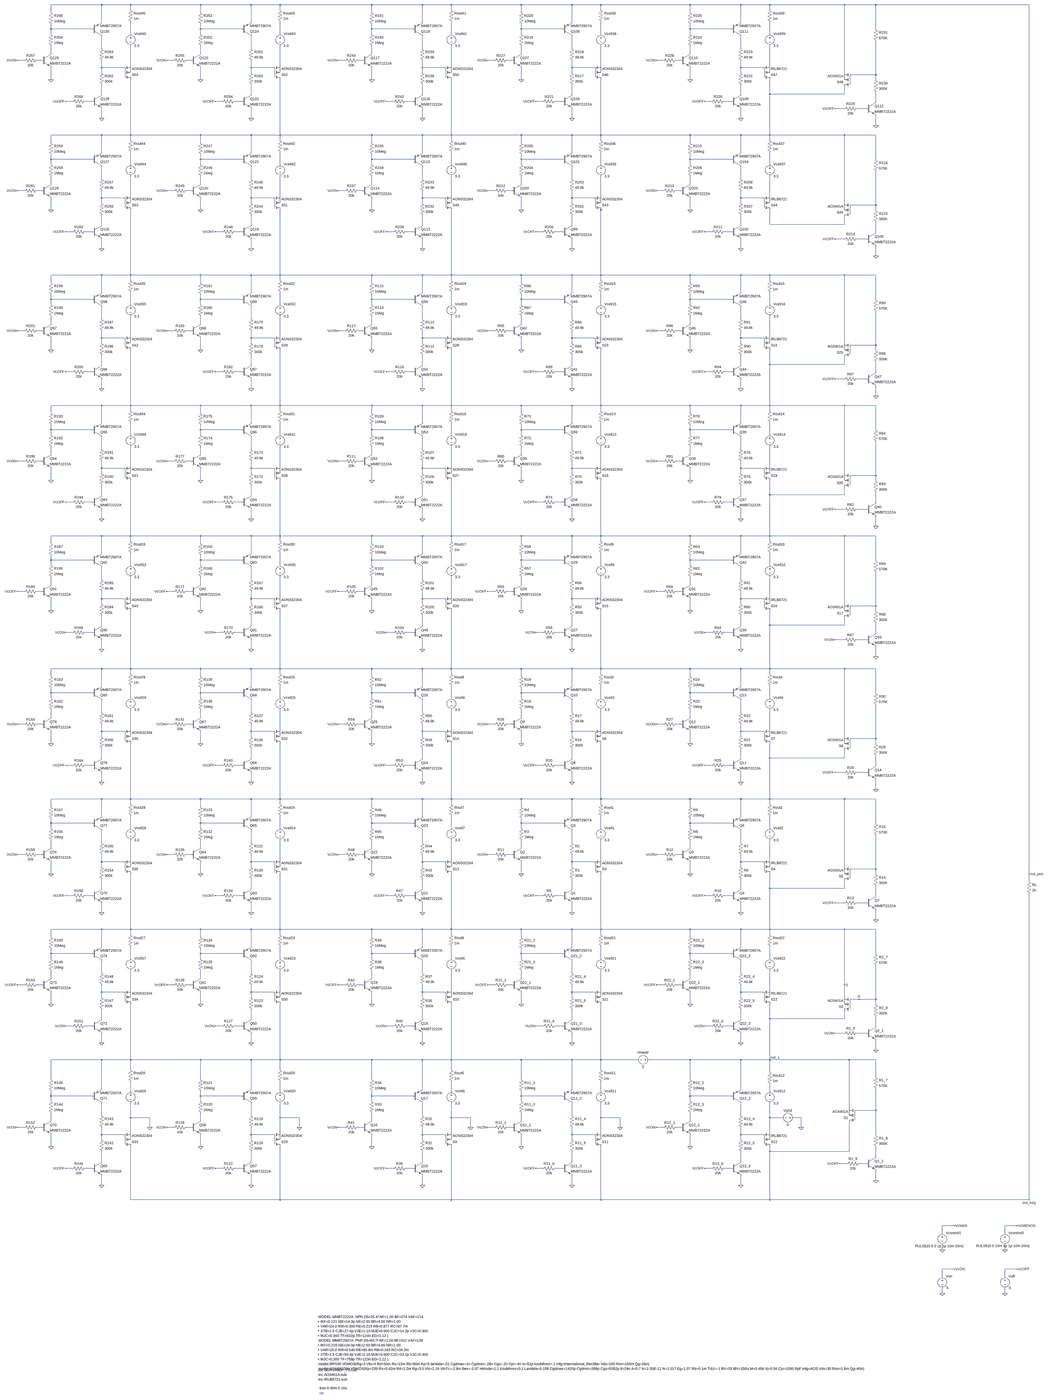
[diagram p0: schematic Matriz_5x9.asc, whole sheet]
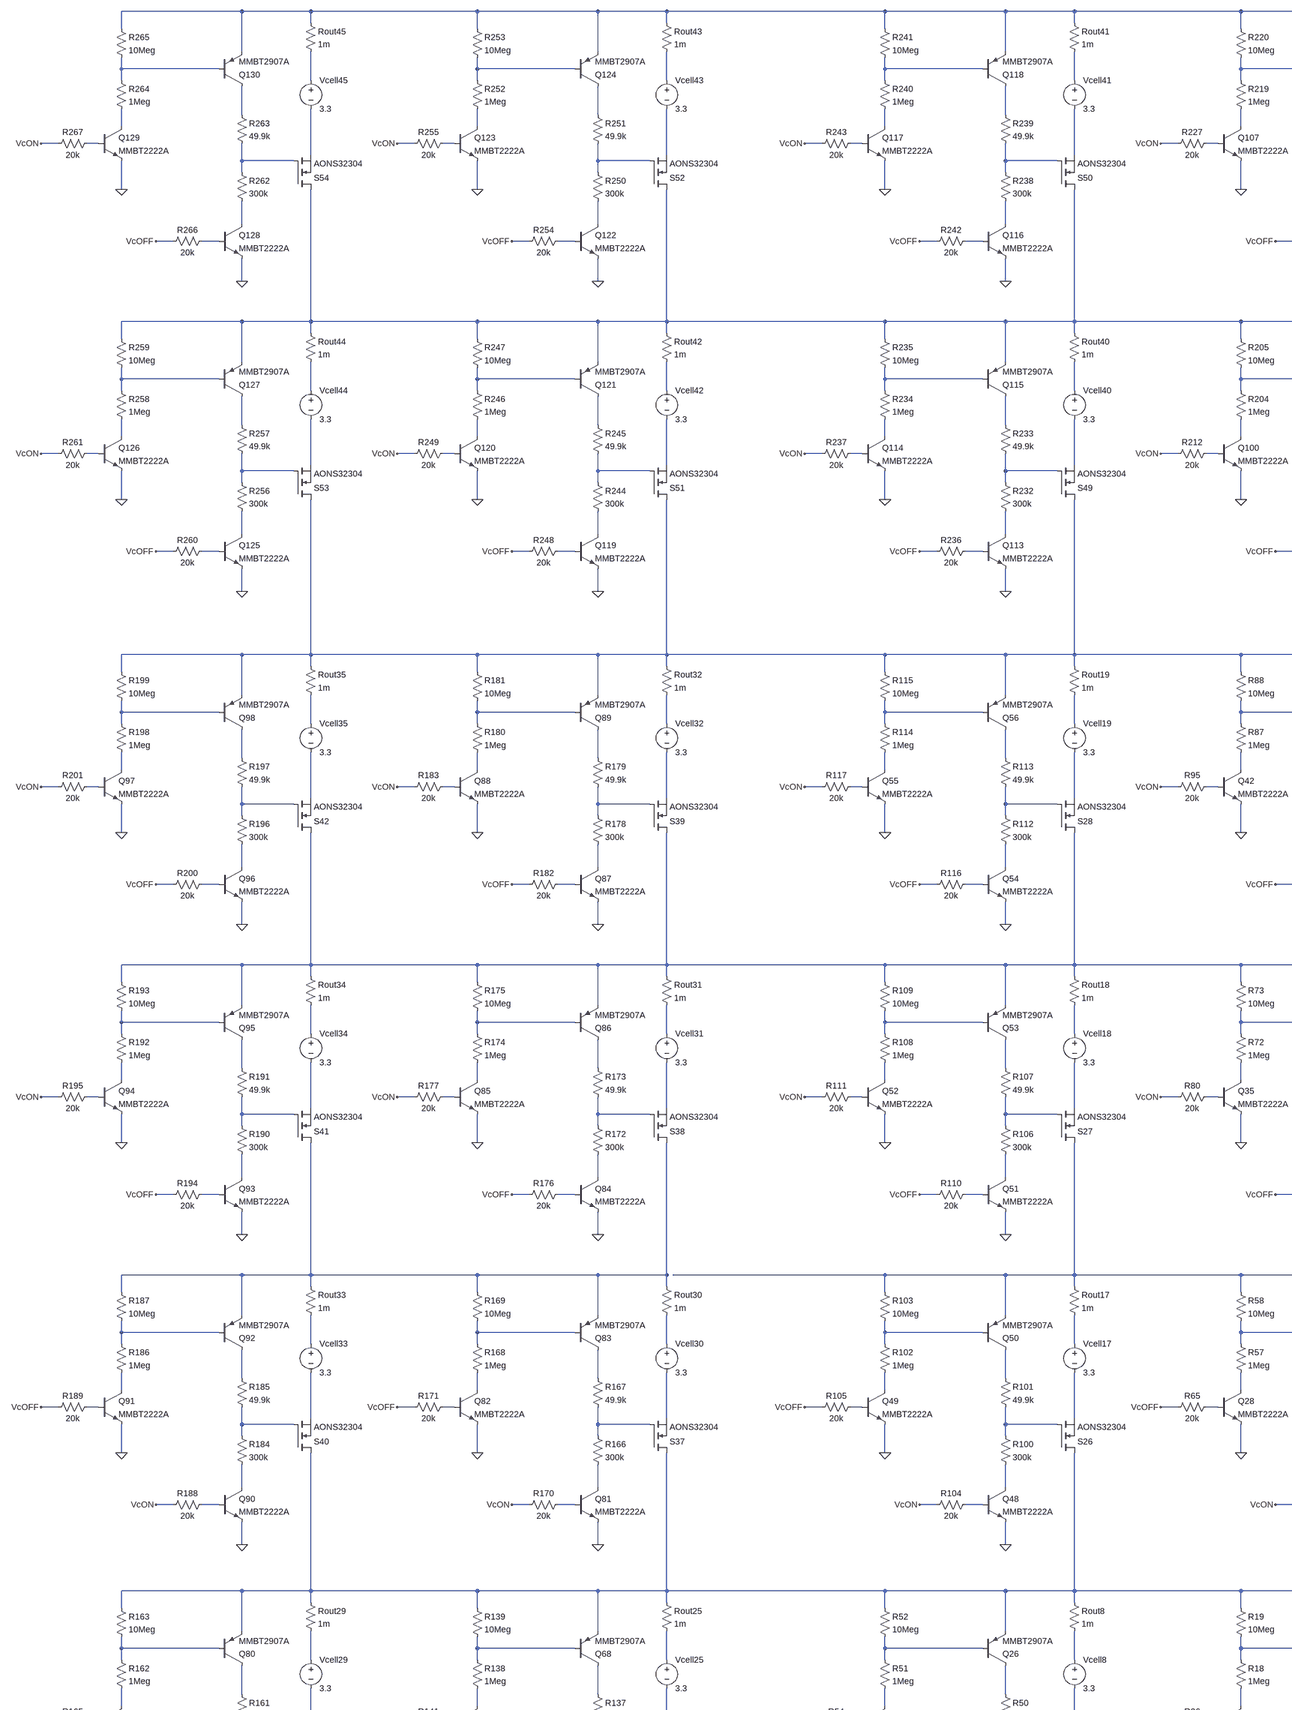
[diagram p1: schematic Matriz_5x9.asc, part, row 1 of 2, column 1 of 2]
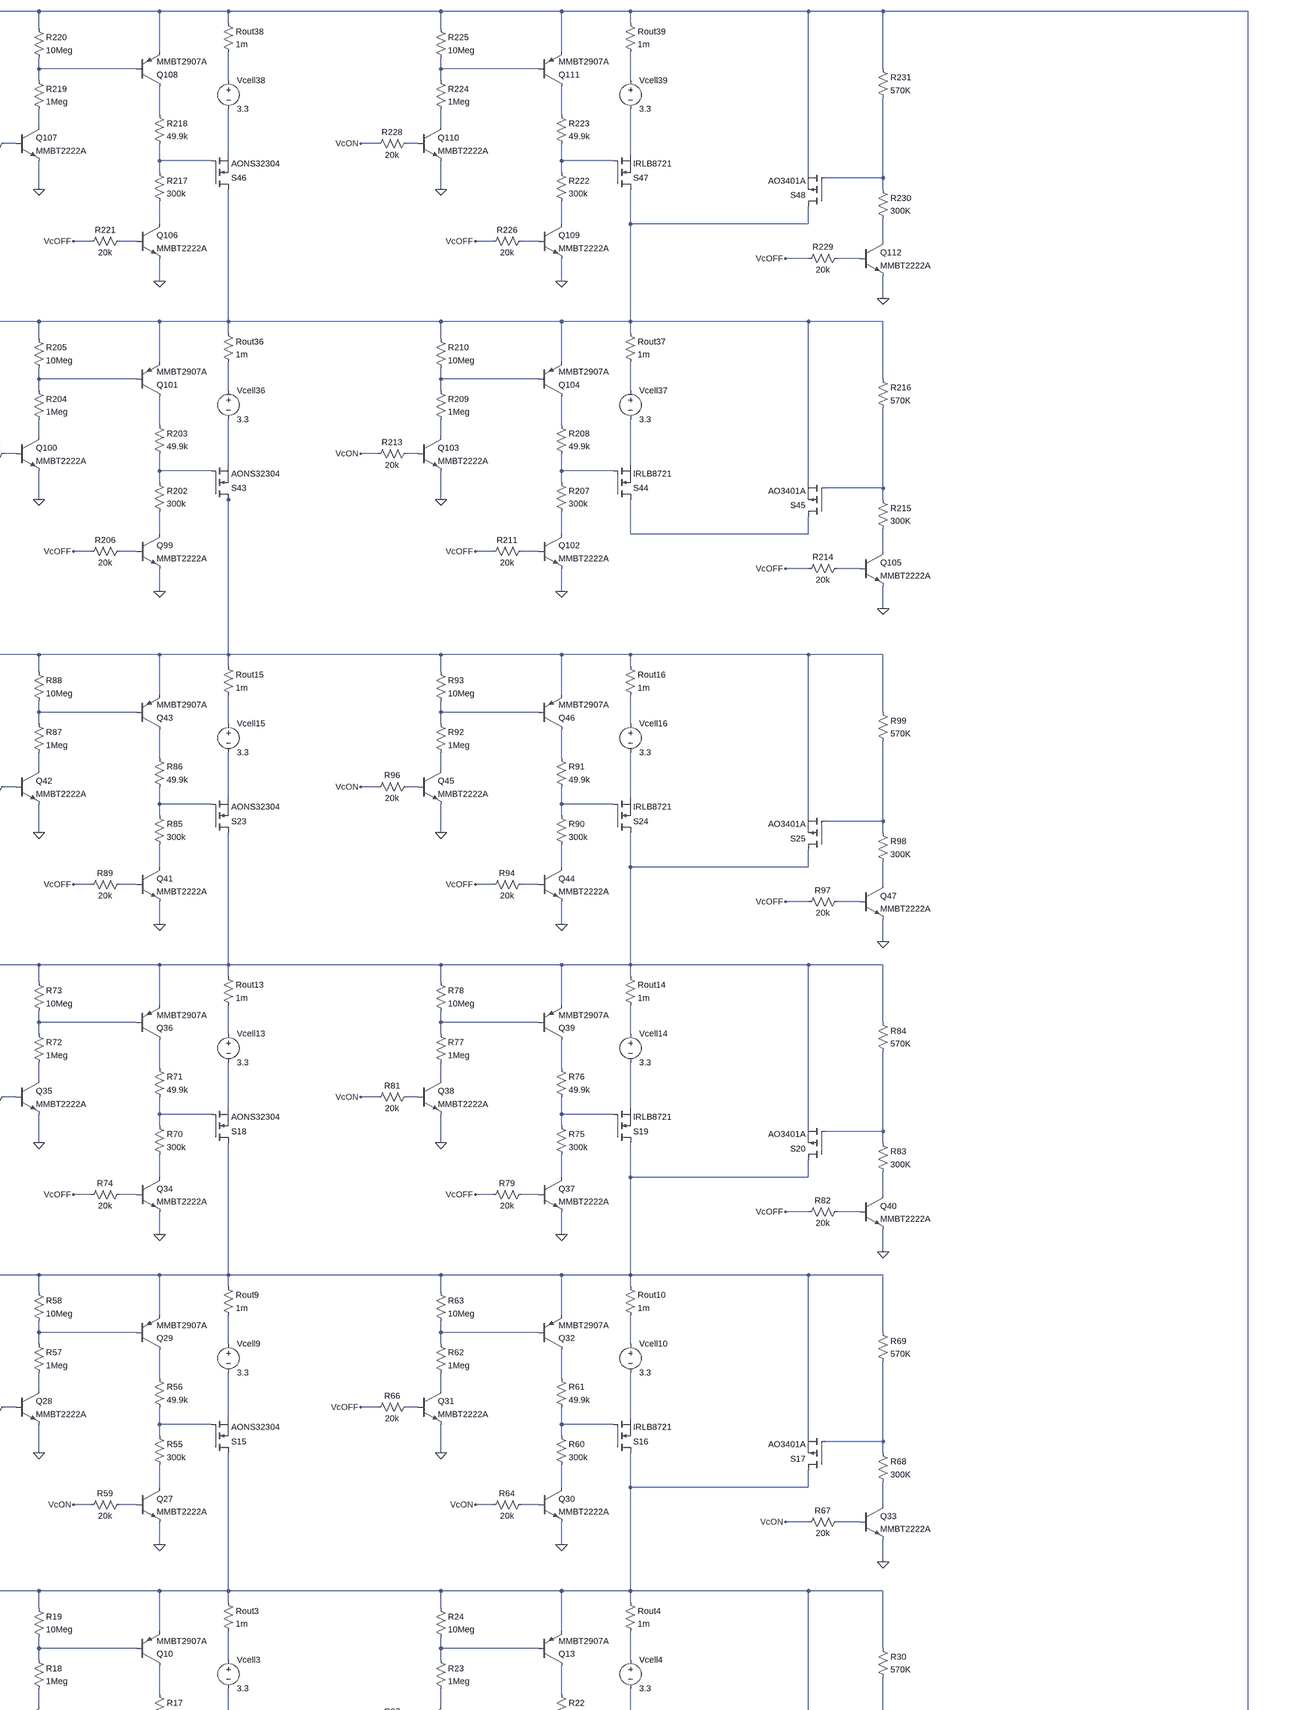
[diagram p2: schematic Matriz_5x9.asc, part, row 1 of 2, column 2 of 2]
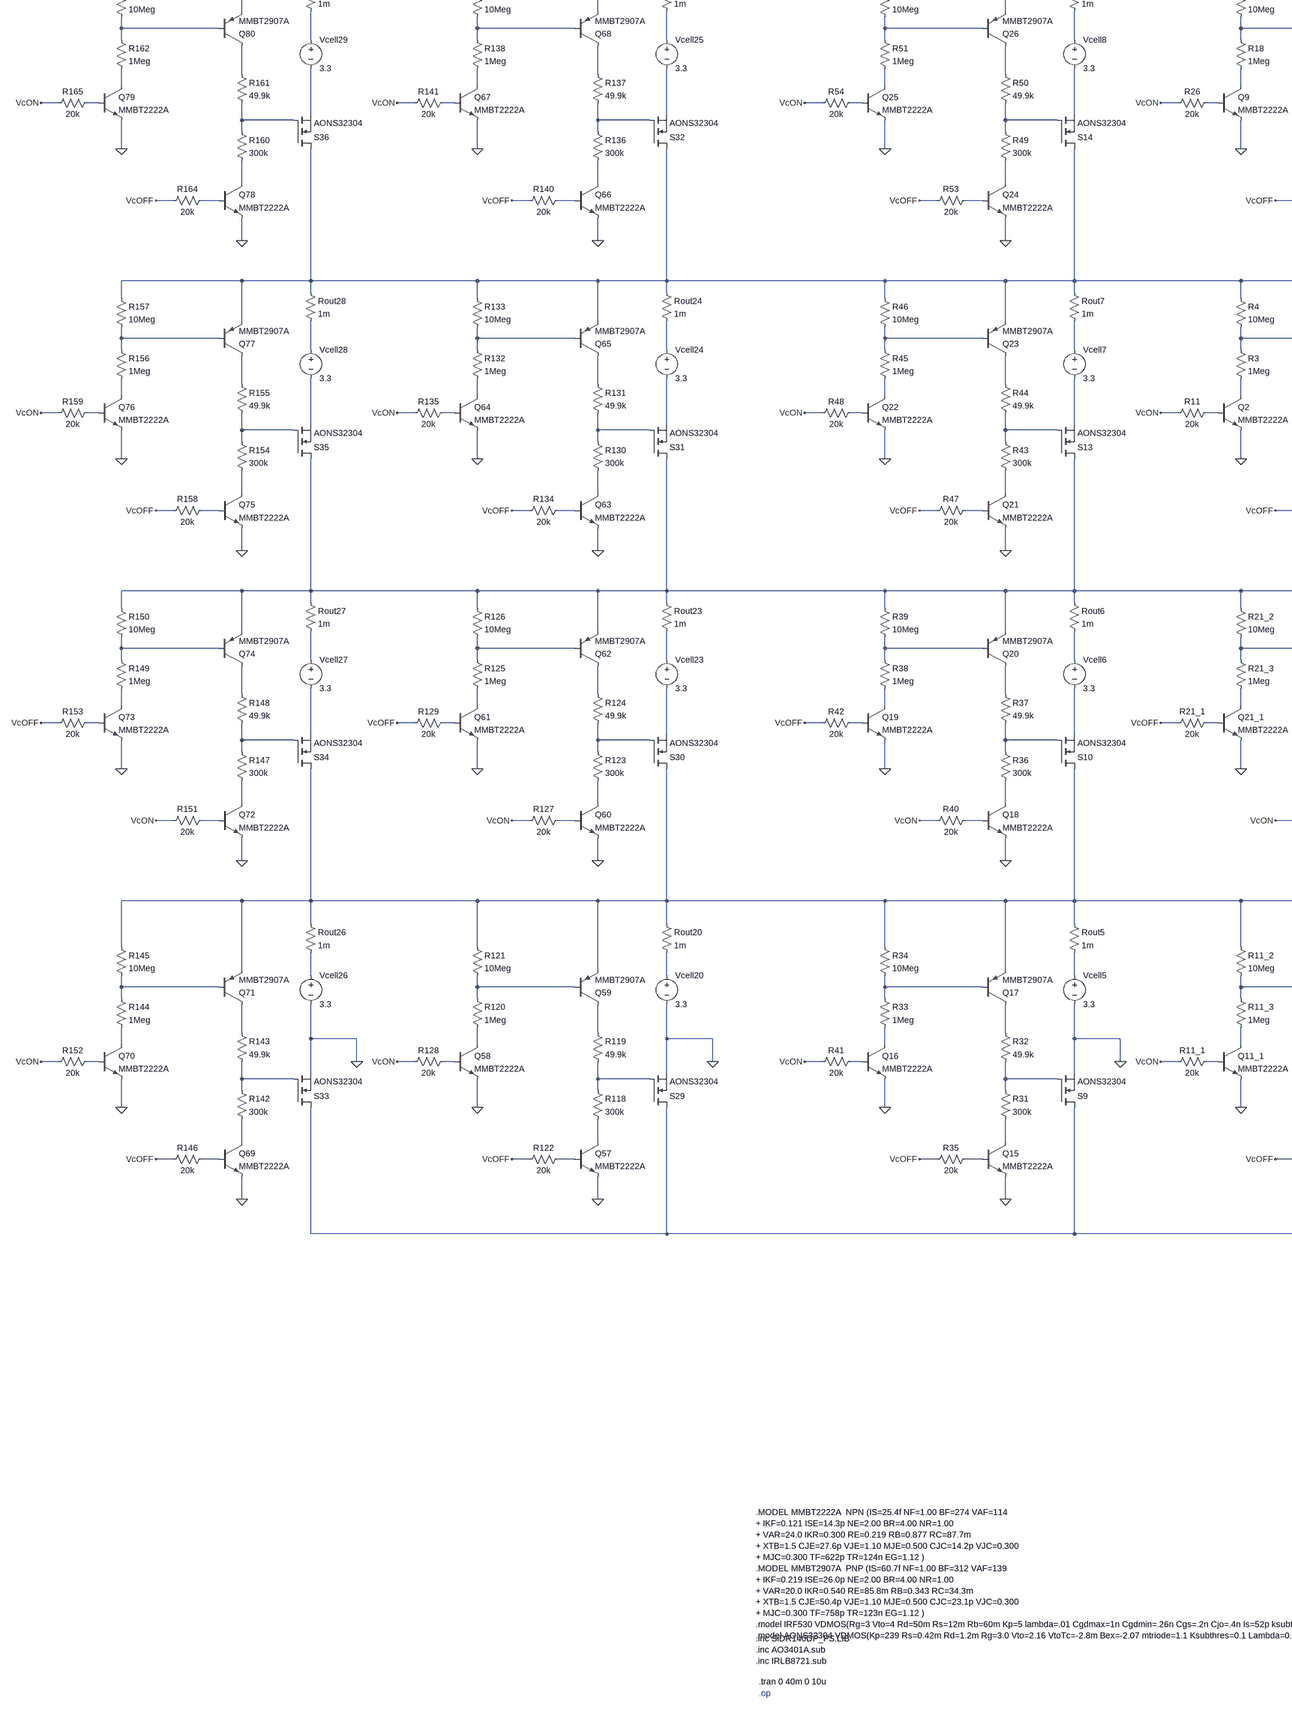
[diagram p3: schematic Matriz_5x9.asc, part, row 2 of 2, column 1 of 2]
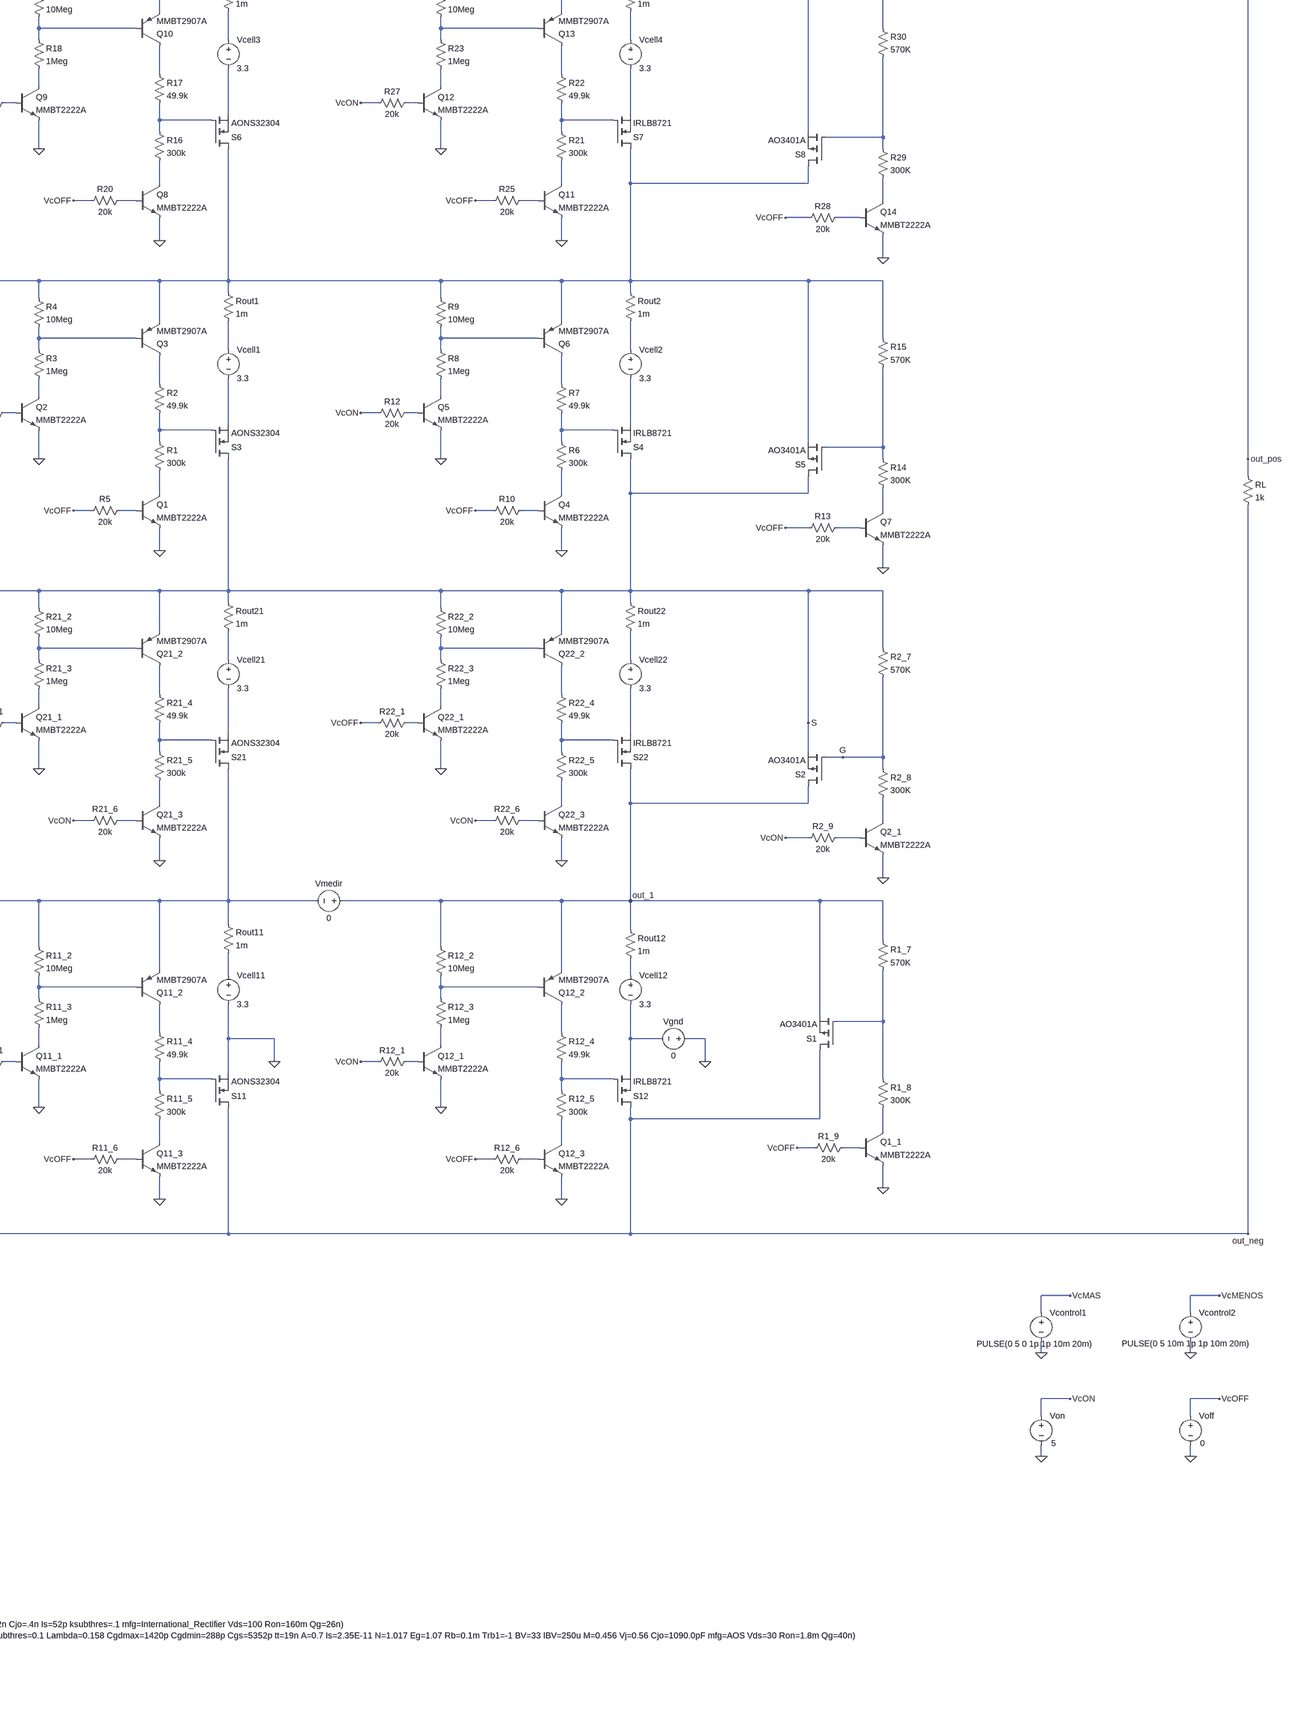
[diagram p4: schematic Matriz_5x9.asc, part, row 2 of 2, column 2 of 2]
* Matriz_5x9.asc
Q11_3 N429 N435 0 0 MMBT2222A
R11_5 N423 N429 300k
R11_4 N407 N423 49.9k
Q11_1 N413 N418 0 0 MMBT2222A
R11_3 N401 N413 1Meg
R11_2 N392 N401 10Meg
R11_6 N435 VcOFF 20k
Vcell11 N396 0 3.3
Q11_2 N407 N401 N392 0 MMBT2907A
M§S11 out_neg N423 0 0 AONS32304
Q12_3 N430 N436 0 0 MMBT2222A
R12_5 N424 N430 300k
R12_4 N408 N424 49.9k
Q12_1 N414 N419 0 0 MMBT2222A
R12_3 N402 N414 1Meg
R12_2 out_1 N402 10Meg
R12_6 N436 VcOFF 20k
Vcell12 N397 N409 3.3
Q12_2 N408 N402 out_1 0 MMBT2907A
XS12 out_neg N424 N409 IRLB8721  ; pins D G S
Q21_3 N383 N388 0 0 MMBT2222A
R21_5 N378 N383 300k
R21_4 N358 N378 49.9k
Q21_1 N363 N368 0 0 MMBT2222A
R21_3 N348 N363 1Meg
R21_2 S N348 10Meg
R21_6 N388 VcON 20k
Vcell21 N353 N373 3.3
Q21_2 N358 N348 S 0 MMBT2907A
M§S21 N392 N378 N373 N373 AONS32304
Q22_3 N384 N389 0 0 MMBT2222A
R22_5 N379 N384 300k
R22_4 N359 N379 49.9k
Q22_1 N364 N369 0 0 MMBT2222A
R22_3 N349 N364 1Meg
R22_2 S N349 10Meg
R22_6 N389 VcON 20k
Vcell22 N354 N374 3.3
Q22_2 N359 N349 S 0 MMBT2907A
XS22 out_1 N379 N374 IRLB8721  ; pins D G S
Vcontrol1 VcMAS 0 PULSE(0 5 0 1p 1p 10m 20m)
Vcontrol2 VcMENOS 0 PULSE(0 5 10m 1p 1p 10m 20m)
Voff VcOFF 0 0
Von VcON 0 5
R11_1 N418 VcON 20k
R21_1 N368 VcOFF 20k
R22_1 N369 VcOFF 20k
R12_1 N419 VcON 20k
RL out_pos out_neg 1k
Rout12 out_1 N397 1m
Rout11 N392 N396 1m
Rout21 S N353 1m
Rout22 S N354 1m
Vmedir out_1 N392 0
Vgnd 0 N409 0
Q1_1 N425 N431 0 0 MMBT2222A
R1_9 N431 VcOFF 20k
R1_8 N403 N425 300K
R1_7 out_1 N403 570K
Q2_1 N390 N391 0 0 MMBT2222A
R2_9 N391 VcON 20k
R2_8 G N390 300K
R2_7 S G 570K
XS1 out_neg N403 out_1 AO3401A  ; pins D G S
XS2 out_1 G S AO3401A  ; pins D G S
Q1 N336 N341 0 0 MMBT2222A
R1 N330 N336 300k
R2 N310 N330 49.9k
Q2 N315 N320 0 0 MMBT2222A
R3 N300 N315 1Meg
R4 N289 N300 10Meg
R5 N341 VcOFF 20k
Vcell1 N305 N325 3.3
Q3 N310 N300 N289 0 MMBT2907A
M§S3 S N330 N325 N325 AONS32304
Q4 N337 N342 0 0 MMBT2222A
R6 N331 N337 300k
R7 N311 N331 49.9k
Q5 N316 N321 0 0 MMBT2222A
R8 N301 N316 1Meg
R9 N289 N301 10Meg
R10 N342 VcOFF 20k
Vcell2 N306 N326 3.3
Q6 N311 N301 N289 0 MMBT2907A
XS4 S N331 N326 IRLB8721  ; pins D G S
R11 N320 VcON 20k
R12 N321 VcON 20k
Rout1 N289 N305 1m
Rout2 N289 N306 1m
Q7 N343 N344 0 0 MMBT2222A
R13 N344 VcOFF 20k
R14 N332 N343 300K
R15 N289 N332 570K
XS5 S N332 N289 AO3401A  ; pins D G S
Q8 N287 N293 0 0 MMBT2222A
R16 N281 N287 300k
R17 N261 N281 49.9k
Q9 N266 N271 0 0 MMBT2222A
R18 N251 N266 1Meg
R19 N240 N251 10Meg
R20 N293 VcOFF 20k
Vcell3 N256 N276 3.3
Q10 N261 N251 N240 0 MMBT2907A
M§S6 N289 N281 N276 N276 AONS32304
Q11 N288 N294 0 0 MMBT2222A
R21 N282 N288 300k
R22 N262 N282 49.9k
Q12 N267 N272 0 0 MMBT2222A
R23 N252 N267 1Meg
R24 N240 N252 10Meg
R25 N294 VcOFF 20k
Vcell4 N257 N277 3.3
Q13 N262 N252 N240 0 MMBT2907A
XS7 N289 N282 N277 IRLB8721  ; pins D G S
R26 N271 VcON 20k
R27 N272 VcON 20k
Rout3 N240 N256 1m
Rout4 N240 N257 1m
Q14 N295 N296 0 0 MMBT2222A
R28 N296 VcOFF 20k
R29 N283 N295 300K
R30 N240 N283 570K
XS8 N289 N283 N240 AO3401A  ; pins D G S
Q15 N428 N434 0 0 MMBT2222A
R31 N422 N428 300k
R32 N406 N422 49.9k
Q16 N412 N417 0 0 MMBT2222A
R33 N400 N412 1Meg
R34 N392 N400 10Meg
R35 N434 VcOFF 20k
Vcell5 N395 0 3.3
Q17 N406 N400 N392 0 MMBT2907A
M§S9 out_neg N422 0 0 AONS32304
Q18 N382 N387 0 0 MMBT2222A
R36 N377 N382 300k
R37 N357 N377 49.9k
Q19 N362 N367 0 0 MMBT2222A
R38 N347 N362 1Meg
R39 S N347 10Meg
R40 N387 VcON 20k
Vcell6 N352 N372 3.3
Q20 N357 N347 S 0 MMBT2907A
M§S10 N392 N377 N372 N372 AONS32304
R41 N417 VcON 20k
R42 N367 VcOFF 20k
Rout5 N392 N395 1m
Rout6 S N352 1m
Q21 N335 N340 0 0 MMBT2222A
R43 N329 N335 300k
R44 N309 N329 49.9k
Q22 N314 N319 0 0 MMBT2222A
R45 N299 N314 1Meg
R46 N289 N299 10Meg
R47 N340 VcOFF 20k
Vcell7 N304 N324 3.3
Q23 N309 N299 N289 0 MMBT2907A
M§S13 S N329 N324 N324 AONS32304
R48 N319 VcON 20k
Rout7 N289 N304 1m
Q24 N286 N292 0 0 MMBT2222A
R49 N280 N286 300k
R50 N260 N280 49.9k
Q25 N265 N270 0 0 MMBT2222A
R51 N250 N265 1Meg
R52 N240 N250 10Meg
R53 N292 VcOFF 20k
Vcell8 N255 N275 3.3
Q26 N260 N250 N240 0 MMBT2907A
M§S14 N289 N280 N275 N275 AONS32304
R54 N270 VcON 20k
Rout8 N240 N255 1m
Q27 N238 N244 0 0 MMBT2222A
R55 N232 N238 300k
R56 N212 N232 49.9k
Q28 N217 N222 0 0 MMBT2222A
R57 N202 N217 1Meg
R58 N190 N202 10Meg
R59 N244 VcON 20k
Vcell9 N207 N227 3.3
Q29 N212 N202 N190 0 MMBT2907A
M§S15 N240 N232 N227 N227 AONS32304
Q30 N239 N245 0 0 MMBT2222A
R60 N233 N239 300k
R61 N213 N233 49.9k
Q31 N218 N223 0 0 MMBT2222A
R62 N203 N218 1Meg
R63 N190 N203 10Meg
R64 N245 VcON 20k
Vcell10 N208 N228 3.3
Q32 N213 N203 N190 0 MMBT2907A
XS16 N240 N233 N228 IRLB8721  ; pins D G S
R65 N222 VcOFF 20k
R66 N223 VcOFF 20k
Rout9 N190 N207 1m
Rout10 N190 N208 1m
Q33 N246 N247 0 0 MMBT2222A
R67 N247 VcON 20k
R68 N234 N246 300K
R69 N190 N234 570K
XS17 N240 N234 N190 AO3401A  ; pins D G S
Q34 N188 N194 0 0 MMBT2222A
R70 N182 N188 300k
R71 N162 N182 49.9k
Q35 N167 N172 0 0 MMBT2222A
R72 N152 N167 1Meg
R73 N141 N152 10Meg
R74 N194 VcOFF 20k
Vcell13 N157 N177 3.3
Q36 N162 N152 N141 0 MMBT2907A
M§S18 N190 N182 N177 N177 AONS32304
Q37 N189 N195 0 0 MMBT2222A
R75 N183 N189 300k
R76 N163 N183 49.9k
Q38 N168 N173 0 0 MMBT2222A
R77 N153 N168 1Meg
R78 N141 N153 10Meg
R79 N195 VcOFF 20k
Vcell14 N158 N178 3.3
Q39 N163 N153 N141 0 MMBT2907A
XS19 N190 N183 N178 IRLB8721  ; pins D G S
R80 N172 VcON 20k
R81 N173 VcON 20k
Rout13 N141 N157 1m
Rout14 N141 N158 1m
Q40 N196 N197 0 0 MMBT2222A
R82 N197 VcOFF 20k
R83 N184 N196 300K
R84 N141 N184 570K
XS20 N190 N184 N141 AO3401A  ; pins D G S
Q41 N139 N145 0 0 MMBT2222A
R85 N133 N139 300k
R86 N113 N133 49.9k
Q42 N118 N123 0 0 MMBT2222A
R87 N103 N118 1Meg
R88 N086 N103 10Meg
R89 N145 VcOFF 20k
Vcell15 N108 N128 3.3
Q43 N113 N103 N086 0 MMBT2907A
M§S23 N141 N133 N128 N128 AONS32304
Q44 N140 N146 0 0 MMBT2222A
R90 N134 N140 300k
R91 N114 N134 49.9k
Q45 N119 N124 0 0 MMBT2222A
R92 N104 N119 1Meg
R93 N086 N104 10Meg
R94 N146 VcOFF 20k
Vcell16 N109 N129 3.3
Q46 N114 N104 N086 0 MMBT2907A
XS24 N141 N134 N129 IRLB8721  ; pins D G S
R95 N123 VcON 20k
R96 N124 VcON 20k
Rout15 N086 N108 1m
Rout16 N086 N109 1m
Q47 N147 N148 0 0 MMBT2222A
R97 N148 VcOFF 20k
R98 N135 N147 300K
R99 N086 N135 570K
XS25 N141 N135 N086 AO3401A  ; pins D G S
Q48 N237 N243 0 0 MMBT2222A
R100 N231 N237 300k
R101 N211 N231 49.9k
Q49 N216 N221 0 0 MMBT2222A
R102 N201 N216 1Meg
R103 N190 N201 10Meg
R104 N243 VcON 20k
Vcell17 N206 N226 3.3
Q50 N211 N201 N190 0 MMBT2907A
M§S26 N240 N231 N226 N226 AONS32304
R105 N221 VcOFF 20k
Rout17 N190 N206 1m
Q51 N187 N193 0 0 MMBT2222A
R106 N181 N187 300k
R107 N161 N181 49.9k
Q52 N166 N171 0 0 MMBT2222A
R108 N151 N166 1Meg
R109 N141 N151 10Meg
R110 N193 VcOFF 20k
Vcell18 N156 N176 3.3
Q53 N161 N151 N141 0 MMBT2907A
M§S27 N190 N181 N176 N176 AONS32304
R111 N171 VcON 20k
Rout18 N141 N156 1m
Q54 N138 N144 0 0 MMBT2222A
R112 N132 N138 300k
R113 N112 N132 49.9k
Q55 N117 N122 0 0 MMBT2222A
R114 N102 N117 1Meg
R115 N086 N102 10Meg
R116 N144 VcOFF 20k
Vcell19 N107 N127 3.3
Q56 N112 N102 N086 0 MMBT2907A
M§S28 N141 N132 N127 N127 AONS32304
R117 N122 VcON 20k
Rout19 N086 N107 1m
Q57 N427 N433 0 0 MMBT2222A
R118 N421 N427 300k
R119 N405 N421 49.9k
Q58 N411 N416 0 0 MMBT2222A
R120 N399 N411 1Meg
R121 N392 N399 10Meg
R122 N433 VcOFF 20k
Vcell20 N394 0 3.3
Q59 N405 N399 N392 0 MMBT2907A
M§S29 out_neg N421 0 0 AONS32304
Q60 N381 N386 0 0 MMBT2222A
R123 N376 N381 300k
R124 N356 N376 49.9k
Q61 N361 N366 0 0 MMBT2222A
R125 N346 N361 1Meg
R126 S N346 10Meg
R127 N386 VcON 20k
Vcell23 N351 N371 3.3
Q62 N356 N346 S 0 MMBT2907A
M§S30 N392 N376 N371 N371 AONS32304
R128 N416 VcON 20k
R129 N366 VcOFF 20k
Rout20 N392 N394 1m
Rout23 S N351 1m
Q63 N334 N339 0 0 MMBT2222A
R130 N328 N334 300k
R131 N308 N328 49.9k
Q64 N313 N318 0 0 MMBT2222A
R132 N298 N313 1Meg
R133 N289 N298 10Meg
R134 N339 VcOFF 20k
Vcell24 N303 N323 3.3
Q65 N308 N298 N289 0 MMBT2907A
M§S31 S N328 N323 N323 AONS32304
R135 N318 VcON 20k
Rout24 N289 N303 1m
Q66 N285 N291 0 0 MMBT2222A
R136 N279 N285 300k
R137 N259 N279 49.9k
Q67 N264 N269 0 0 MMBT2222A
R138 N249 N264 1Meg
R139 N240 N249 10Meg
R140 N291 VcOFF 20k
Vcell25 N254 N274 3.3
Q68 N259 N249 N240 0 MMBT2907A
M§S32 N289 N279 N274 N274 AONS32304
R141 N269 VcON 20k
Rout25 N240 N254 1m
Q69 N426 N432 0 0 MMBT2222A
R142 N420 N426 300k
R143 N404 N420 49.9k
Q70 N410 N415 0 0 MMBT2222A
R144 N398 N410 1Meg
R145 N392 N398 10Meg
R146 N432 VcOFF 20k
Vcell26 N393 0 3.3
Q71 N404 N398 N392 0 MMBT2907A
M§S33 out_neg N420 0 0 AONS32304
Q72 N380 N385 0 0 MMBT2222A
R147 N375 N380 300k
R148 N355 N375 49.9k
Q73 N360 N365 0 0 MMBT2222A
R149 N345 N360 1Meg
R150 S N345 10Meg
R151 N385 VcON 20k
Vcell27 N350 N370 3.3
Q74 N355 N345 S 0 MMBT2907A
M§S34 N392 N375 N370 N370 AONS32304
R152 N415 VcON 20k
R153 N365 VcOFF 20k
Rout26 N392 N393 1m
Rout27 S N350 1m
Q75 N333 N338 0 0 MMBT2222A
R154 N327 N333 300k
R155 N307 N327 49.9k
Q76 N312 N317 0 0 MMBT2222A
R156 N297 N312 1Meg
R157 N289 N297 10Meg
R158 N338 VcOFF 20k
Vcell28 N302 N322 3.3
Q77 N307 N297 N289 0 MMBT2907A
M§S35 S N327 N322 N322 AONS32304
R159 N317 VcON 20k
Rout28 N289 N302 1m
Q78 N284 N290 0 0 MMBT2222A
R160 N278 N284 300k
R161 N258 N278 49.9k
Q79 N263 N268 0 0 MMBT2222A
R162 N248 N263 1Meg
R163 N240 N248 10Meg
R164 N290 VcOFF 20k
Vcell29 N253 N273 3.3
Q80 N258 N248 N240 0 MMBT2907A
M§S36 N289 N278 N273 N273 AONS32304
R165 N268 VcON 20k
Rout29 N240 N253 1m
Q81 N236 N242 0 0 MMBT2222A
R166 N230 N236 300k
R167 N210 N230 49.9k
Q82 N215 N220 0 0 MMBT2222A
R168 N200 N215 1Meg
R169 N198 N200 10Meg
R170 N242 VcON 20k
Vcell30 N205 N225 3.3
Q83 N210 N200 N198 0 MMBT2907A
M§S37 N240 N230 N225 N225 AONS32304
R171 N220 VcOFF 20k
Rout30 N198 N205 1m
Q84 N186 N192 0 0 MMBT2222A
R172 N180 N186 300k
R173 N160 N180 49.9k
Q85 N165 N170 0 0 MMBT2222A
R174 N150 N165 1Meg
R175 N141 N150 10Meg
R176 N192 VcOFF 20k
Vcell31 N155 N175 3.3
Q86 N160 N150 N141 0 MMBT2907A
M§S38 N198 N180 N175 N175 AONS32304
R177 N170 VcON 20k
Rout31 N141 N155 1m
Q87 N137 N143 0 0 MMBT2222A
R178 N131 N137 300k
R179 N111 N131 49.9k
Q88 N116 N121 0 0 MMBT2222A
R180 N101 N116 1Meg
R181 N086 N101 10Meg
R182 N143 VcOFF 20k
Vcell32 N106 N126 3.3
Q89 N111 N101 N086 0 MMBT2907A
M§S39 N141 N131 N126 N126 AONS32304
R183 N121 VcON 20k
Rout32 N086 N106 1m
Q90 N235 N241 0 0 MMBT2222A
R184 N229 N235 300k
R185 N209 N229 49.9k
Q91 N214 N219 0 0 MMBT2222A
R186 N199 N214 1Meg
R187 N198 N199 10Meg
R188 N241 VcON 20k
Vcell33 N204 N224 3.3
Q92 N209 N199 N198 0 MMBT2907A
M§S40 N240 N229 N224 N224 AONS32304
R189 N219 VcOFF 20k
Rout33 N198 N204 1m
Q93 N185 N191 0 0 MMBT2222A
R190 N179 N185 300k
R191 N159 N179 49.9k
Q94 N164 N169 0 0 MMBT2222A
R192 N149 N164 1Meg
R193 N141 N149 10Meg
R194 N191 VcOFF 20k
Vcell34 N154 N174 3.3
Q95 N159 N149 N141 0 MMBT2907A
M§S41 N198 N179 N174 N174 AONS32304
R195 N169 VcON 20k
Rout34 N141 N154 1m
Q96 N136 N142 0 0 MMBT2222A
R196 N130 N136 300k
R197 N110 N130 49.9k
Q97 N115 N120 0 0 MMBT2222A
R198 N100 N115 1Meg
R199 N086 N100 10Meg
R200 N142 VcOFF 20k
Vcell35 N105 N125 3.3
Q98 N110 N100 N086 0 MMBT2907A
M§S42 N141 N130 N125 N125 AONS32304
R201 N120 VcON 20k
Rout35 N086 N105 1m
Q99 N090 N096 0 0 MMBT2222A
R202 N083 N090 300k
R203 N063 N083 49.9k
Q100 N068 N073 0 0 MMBT2222A
R204 N053 N068 1Meg
R205 N042 N053 10Meg
R206 N096 VcOFF 20k
Vcell36 N058 N078 3.3
Q101 N063 N053 N042 0 MMBT2907A
M§S43 N086 N083 N078 N078 AONS32304
Q102 N091 N097 0 0 MMBT2222A
R207 N084 N091 300k
R208 N064 N084 49.9k
Q103 N069 N074 0 0 MMBT2222A
R209 N054 N069 1Meg
R210 N042 N054 10Meg
R211 N097 VcOFF 20k
Vcell37 N059 N079 3.3
Q104 N064 N054 N042 0 MMBT2907A
XS44 N092 N084 N079 IRLB8721  ; pins D G S
R212 N073 VcON 20k
R213 N074 VcON 20k
Rout36 N042 N058 1m
Rout37 N042 N059 1m
Q105 N098 N099 0 0 MMBT2222A
R214 N099 VcOFF 20k
R215 N085 N098 300K
R216 N042 N085 570K
XS45 N092 N085 N042 AO3401A  ; pins D G S
Q106 N040 N046 0 0 MMBT2222A
R217 N034 N040 300k
R218 N014 N034 49.9k
Q107 N019 N024 0 0 MMBT2222A
R219 N004 N019 1Meg
R220 out_pos N004 10Meg
R221 N046 VcOFF 20k
Vcell38 N009 N029 3.3
Q108 N014 N004 out_pos 0 MMBT2907A
M§S46 N042 N034 N029 N029 AONS32304
Q109 N041 N047 0 0 MMBT2222A
R222 N035 N041 300k
R223 N015 N035 49.9k
Q110 N020 N025 0 0 MMBT2222A
R224 N005 N020 1Meg
R225 out_pos N005 10Meg
R226 N047 VcOFF 20k
Vcell39 N010 N030 3.3
Q111 N015 N005 out_pos 0 MMBT2907A
XS47 N042 N035 N030 IRLB8721  ; pins D G S
R227 N024 VcON 20k
R228 N025 VcON 20k
Rout38 out_pos N009 1m
Rout39 out_pos N010 1m
Q112 N048 N049 0 0 MMBT2222A
R229 N049 VcOFF 20k
R230 N036 N048 300K
R231 out_pos N036 570K
XS48 N042 N036 out_pos AO3401A  ; pins D G S
Q113 N089 N095 0 0 MMBT2222A
R232 N082 N089 300k
R233 N062 N082 49.9k
Q114 N067 N072 0 0 MMBT2222A
R234 N052 N067 1Meg
R235 N042 N052 10Meg
R236 N095 VcOFF 20k
Vcell40 N057 N077 3.3
Q115 N062 N052 N042 0 MMBT2907A
M§S49 N086 N082 N077 N077 AONS32304
R237 N072 VcON 20k
Rout40 N042 N057 1m
Q116 N039 N045 0 0 MMBT2222A
R238 N033 N039 300k
R239 N013 N033 49.9k
Q117 N018 N023 0 0 MMBT2222A
R240 N003 N018 1Meg
R241 out_pos N003 10Meg
R242 N045 VcOFF 20k
Vcell41 N008 N028 3.3
Q118 N013 N003 out_pos 0 MMBT2907A
M§S50 N042 N033 N028 N028 AONS32304
R243 N023 VcON 20k
Rout41 out_pos N008 1m
Q119 N088 N094 0 0 MMBT2222A
R244 N081 N088 300k
R245 N061 N081 49.9k
Q120 N066 N071 0 0 MMBT2222A
R246 N051 N066 1Meg
R247 N042 N051 10Meg
R248 N094 VcOFF 20k
Vcell42 N056 N076 3.3
Q121 N061 N051 N042 0 MMBT2907A
M§S51 N086 N081 N076 N076 AONS32304
R249 N071 VcON 20k
Rout42 N042 N056 1m
Q122 N038 N044 0 0 MMBT2222A
R250 N032 N038 300k
R251 N012 N032 49.9k
Q123 N017 N022 0 0 MMBT2222A
R252 N002 N017 1Meg
R253 out_pos N002 10Meg
R254 N044 VcOFF 20k
Vcell43 N007 N027 3.3
Q124 N012 N002 out_pos 0 MMBT2907A
M§S52 N042 N032 N027 N027 AONS32304
R255 N022 VcON 20k
Rout43 out_pos N007 1m
Q125 N087 N093 0 0 MMBT2222A
R256 N080 N087 300k
R257 N060 N080 49.9k
Q126 N065 N070 0 0 MMBT2222A
R258 N050 N065 1Meg
R259 N042 N050 10Meg
R260 N093 VcOFF 20k
Vcell44 N055 N075 3.3
Q127 N060 N050 N042 0 MMBT2907A
M§S53 N086 N080 N075 N075 AONS32304
R261 N070 VcON 20k
Rout44 N042 N055 1m
Q128 N037 N043 0 0 MMBT2222A
R262 N031 N037 300k
R263 N011 N031 49.9k
Q129 N016 N021 0 0 MMBT2222A
R264 N001 N016 1Meg
R265 out_pos N001 10Meg
R266 N043 VcOFF 20k
Vcell45 N006 N026 3.3
Q130 N011 N001 out_pos 0 MMBT2907A
M§S54 N042 N031 N026 N026 AONS32304
R267 N021 VcON 20k
Rout45 out_pos N006 1m
.model NPN NPN
.model PNP PNP
.lib standard.bjt
.model NMOS NMOS
.model PMOS PMOS
.lib standard.mos
.tran 0 40m 0 10u
.MODEL MMBT2222A  NPN (IS=25.4f NF=1.00 BF=274 VAF=114
+ IKF=0.121 ISE=14.3p NE=2.00 BR=4.00 NR=1.00
+ VAR=24.0 IKR=0.300 RE=0.219 RB=0.877 RC=87.7m
+ XTB=1.5 CJE=27.6p VJE=1.10 MJE=0.500 CJC=14.2p VJC=0.300
+ MJC=0.300 TF=622p TR=124n EG=1.12 )
.MODEL MMBT2907A  PNP (IS=60.7f NF=1.00 BF=312 VAF=139
+ IKF=0.219 ISE=26.0p NE=2.00 BR=4.00 NR=1.00
+ VAR=20.0 IKR=0.540 RE=85.8m RB=0.343 RC=34.3m
+ XTB=1.5 CJE=50.4p VJE=1.10 MJE=0.500 CJC=23.1p VJC=0.300
+ MJC=0.300 TF=758p TR=123n EG=1.12 )
.model IRF530 VDMOS(Rg=3 Vto=4 Rd=50m Rs=12m Rb=60m Kp=5 lambda=.01 Cgdmax=1n Cgdmin=.26n Cgs=.2n Cjo=.4n Is=52p ksubthres=.1 mfg=International_Rectifier Vds=100 Ron=160m Qg=26n)
.model AONS32304 VDMOS(Kp=239 Rs=0.42m Rd=1.2m Rg=3.0 Vto=2.16 VtoTc=-2.8m Bex=-2.07 mtriode=1.1 Ksubthres=0.1 Lambda=0.158 Cgdmax=1420p Cgdmin=288p Cgs=5352p tt=19n A=0.7 Is=2.35E-11 N=1.017 Eg=1.07 Rb=0.1m Trb1=-1 BV=33 IBV=250u M=0.456 Vj=0.56 Cjo=1090.0pF mfg=AOS Vds=30 Ron=1.8m Qg=40n)
.inc SiDR140DP_PS.LIB
.inc AO3401A.sub
.inc IRLB8721.sub
* .op
.backanno
.end